# EAGLE design mosfet_brd (EAGLE 9.0.1)
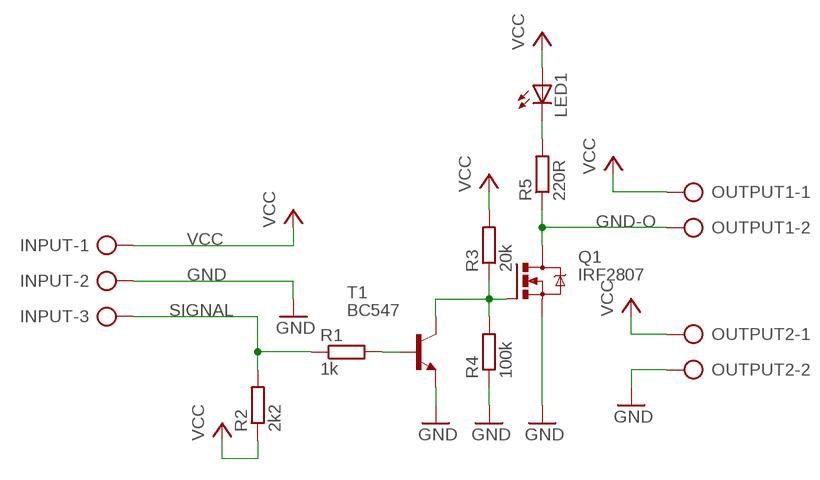
[diagram p0: schematic, sheet 1]

## Parts
INPUT  AK300/3  [AK300/3]
LED1  LED3MM  [LED3MM]
OUTPUT1  AK300/2  [AK300/2]
OUTPUT2  AK300/2  [AK300/2]
Q1  IRF2807  IRF540  [TO220BV]
R1  1k  R-EU_0411/15  [0411/15]
R2  2k2  R-EU_0411/15  [0411/15]
R3  20k  R-EU_0411/15  [0411/15]
R4  100k  R-EU_0411/15  [0411/15]
R5  220R  R-EU_0411/15  [0411/15]
T1  BC547  BC548  [TO92-EBC]

## Nets
GND: INPUT.2 OUTPUT2.2 Q1.S R4.1 T1.E
GND-O: OUTPUT1.2 Q1.D R5.1
N$2: R1.2 T1.B
N$5: Q1.G R3.1 R4.2 T1.C
N$7: LED1.K(C) R5.2
SIGNAL: INPUT.3 R1.1 R2.2
VCC: INPUT.1 LED1.A OUTPUT1.1 OUTPUT2.1 R2.1 R3.2

## Library data of the parts
INPUT = con-ptr500:AK300/3: CONNECTOR; OC_FARNELL: unknown; OC_NEWARK: unknown
LED1 = led:LED: LED OSRAM: - CHIPLED LG R971, LG N971, LY N971, LG Q971, LY Q971, LO R971, LY R971 LH N974, LH R974 LS Q976, LO Q976, LY Q976 LO Q996 - Hyper CHIPLED LW Q18S LB Q993, LB Q99A, LB R99A - SideLED LS A670, LO A670, LY A670, LG A670, LP A670 LB A673, LV A673, LT A673, LW A673 LH A674 LY A675 LS A676, LA A676, LO A676, LY A676, LW A676 LS A679, LY A679, LG A679 - Hyper Micro SIDELED® LS Y876, LA Y876, LO Y876, LY Y876 LT Y87S - SmartLED LW L88C, LW L88S LB L89C, LB L89S, LG L890 LS L89K, LO L89K, LY L89K LS L896, LA L896, LO L896, LY L896 - TOPLED LS T670, LO T670, LY T670, LG T670, LP T670 LSG T670, LSP T670, LSY T670, LOP T670, LYG T670 LG T671, LOG T671, LSG T671 LB T673, LV T673, LT T673, LW T673 LH T674 LS T676, LA T676, LO T676, LY T676, LB T676, LH T676, LSB T676, LW T676 LB T67C, LV T67C, LT T67C, LS T67K, LO T67K, LY T67K, LW E67C LS E67B, LA E67B, LO E67B, LY E67B, LB E67C, LV E67C, LT E67C LW T67C LS T679, LY T679, LG T679 LS T770, LO T770, LY T770, LG T770, LP T770 LB T773, LV T773, LT T773, LW T773 LH T774 LS E675, LA E675, LY E675, LS T675 LS T776, LA T776, LO T776, LY T776, LB T776 LHGB T686 LT T68C, LB T68C - Hyper Mini TOPLED® LB M676 - Mini TOPLED Santana® LG M470 LS M47K, LO M47K, LY M47K Source: http://www.osram.convergy.de LUXEON: - LUMILED® LXK2-PW12-R00, LXK2-PW12-S00, LXK2-PW14-U00, LXK2-PW14-V00 LXK2-PM12-R00, LXK2-PM12-S00, LXK2-PM14-U00 LXK2-PE12-Q00, LXK2-PE12-R00, LXK2-PE12-S00, LXK2-PE14-T00, LXK2-PE14-U00 LXK2-PB12-K00, LXK2-PB12-L00, LXK2-PB12-M00, LXK2-PB14-N00, LXK2-PB14-P00, LXK2-PB14-Q00 LXK2-PR12-L00, LXK2-PR12-M00, LXK2-PR14-Q00, LXK2-PR14-R00 LXK2-PD12-Q00, LXK2-PD12-R00, LXK2-PD12-S00 LXK2-PH12-R00, LXK2-PH12-S00 LXK2-PL12-P00, LXK2-PL12-Q00, LXK2-PL12-R00 Source: www.luxeon.com KINGBRIGHT: KA-3528ASYC Source: www.kingbright.com
OUTPUT1 OUTPUT2 = con-ptr500:AK300/2: CONNECTOR; OC_FARNELL: unknown; OC_NEWARK: unknown
Q1 = transistor-power:IRF540: HEXFET Power MOSFET
R1-R5 = resistor:R-EU_: RESISTOR, European symbol
T1 = transistor-npn:BC548*: NPN Transistor

## Board
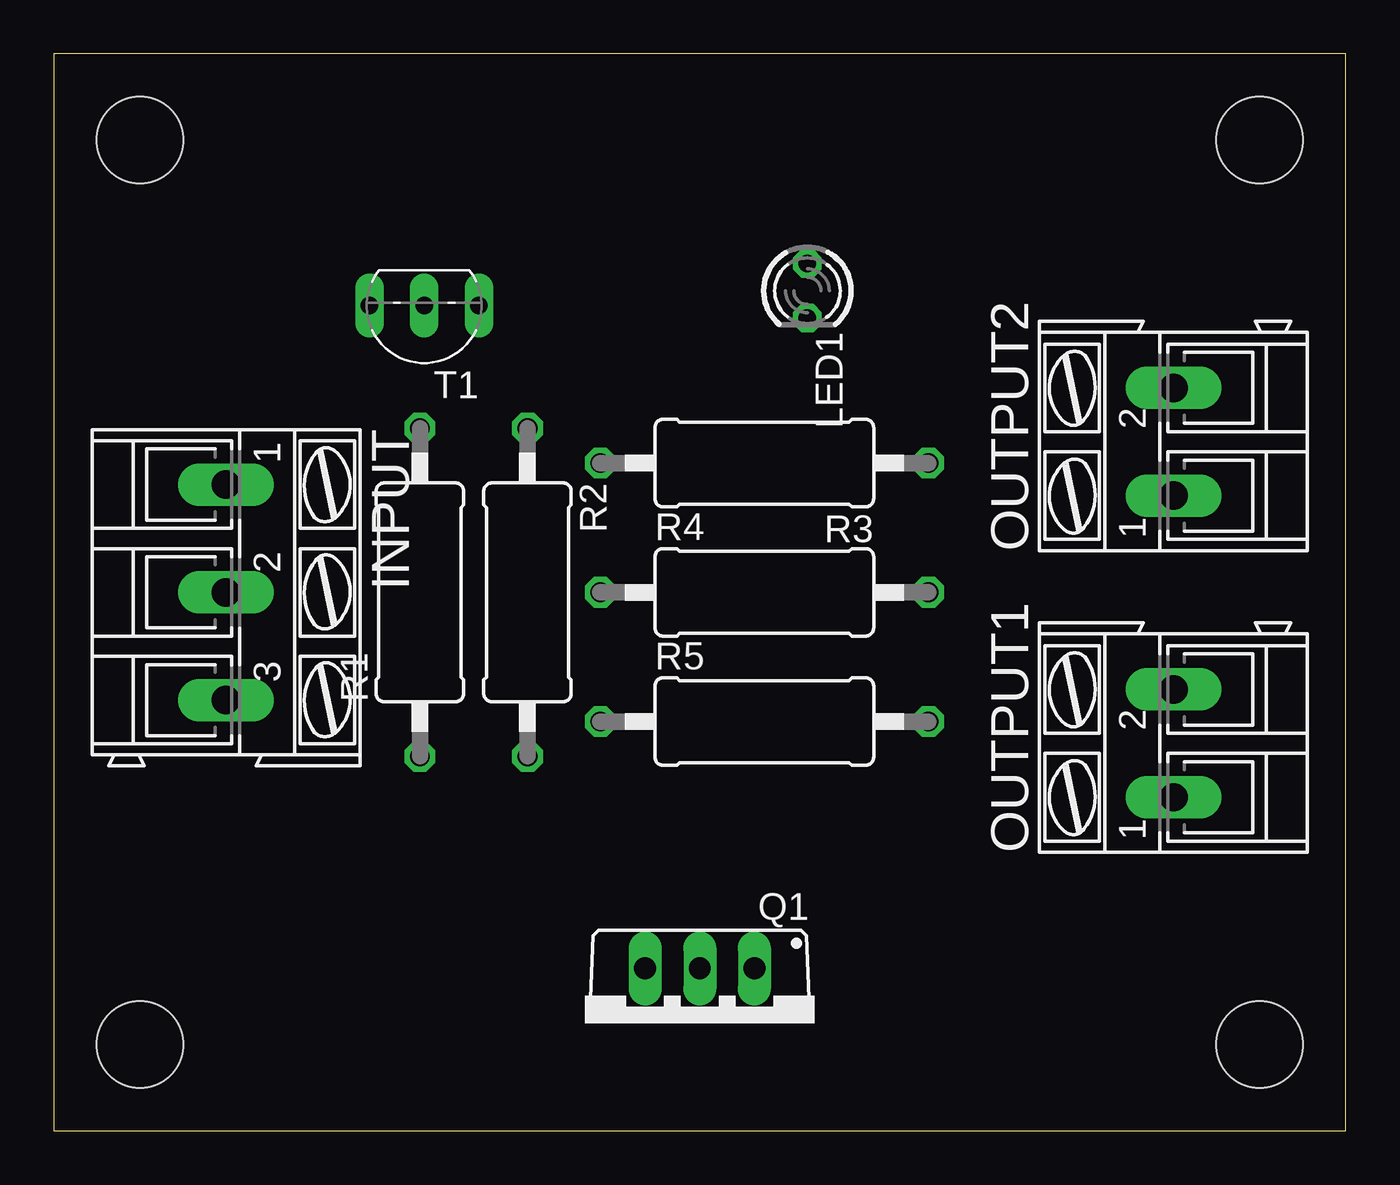
[diagram p1: board, top side]
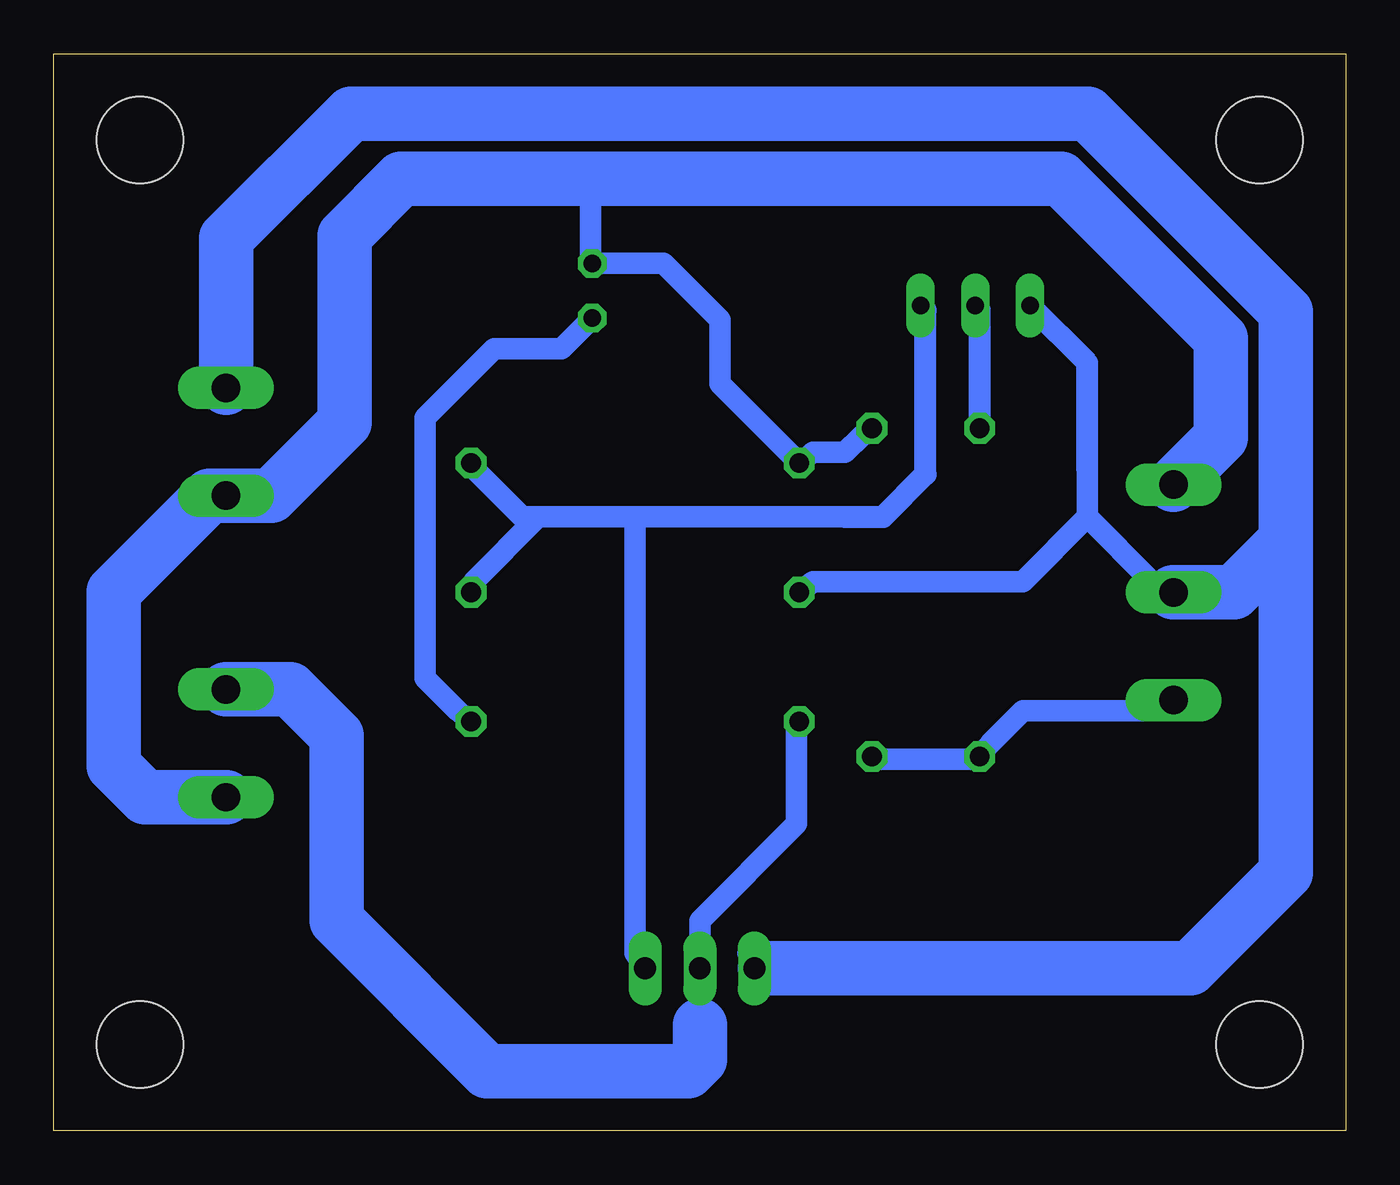
[diagram p2: board, bottom side, seen from below]

Size 60 x 50 mm. Coordinates in mm from the lower left corner, seen from the top.
Outline: 0,0 60,0 60,50 0,50 0,0
Copper layers (1*16): Top 0.035mm / dielectric 1.5mm / Bottom 0.035mm
Design rules "default *": minimum track width 1mm, minimum drill 1mm, track to track 0.5mm, track to pad 0.5mm, pad to pad 0.5mm, via to via 0.5mm, smd to smd 1mm, copper to edge 1.5mm, drill to drill 1.5mm, minimum pad ring 10mil, minimum via ring 8mil, stop-mask expansion 4mil, vias tented up to drill 0mil, thermal gap 0mil
Holes 4 mm at 4,46 56,46 56,4 4,4

### Footprints (pad centres in the part's own frame; a part is rotated, then mirrored left to right if it is on the bottom)
AK300/3 = drill 1.321 long: 1 -5.004,0; 2 0,0; 3 5.004,0
LED3MM = drill 0.813 octagon: A -1.27,0; K 1.27,0
AK300/2 = drill 1.321 long: 1 -2.515,0; 2 2.489,0
TO220BV = drill 1.016 long: D 0,-2.54; G -2.54,-2.54; S 2.54,-2.54
0411/15 = drill 0.914 octagon: 1 -7.62,0; 2 7.62,0
TO92-EBC = drill 0.813 long: B 0,-1.27; C -2.54,-1.27; E 2.54,-1.27

### Placement (x,y rotation side)
INPUT  8,25 270 top
LED1  35,39 270 top
OUTPUT1  52,18 90 top
OUTPUT2  52,32 90 top
Q1  30,5 180 top
R1  17,25 90 top
R2  22,25 270 top
R3  33,31 180 top
R4  33,25 0 top
R5  33,19 0 top
T1  17.2,37.04 180 top

### Tracks (layer width: path | path; a pad name or v marks a point on that pad's centre or on a via)
GND
  Bottom 1: 12,28.5 12,30.75 | 12,28.5 9,25.5 INPUT.2 | 12,28.5 15,25.5 24.75,25.5 R4.1 | Q1.S 27.75,8.25 26.96,7.54
  Bottom 1.016: 12,30.75 12,35.65 T1.E
  Bottom 2.54: INPUT.2 5.19,25 2.77,27.42 | OUTPUT2.2 52,41.43 46.2,47.23 11.98,47.23 2.77,38.02 2.77,27.42 | 26.96,7.54 7.21,7.54 2.77,11.98 2.77,27.42
GND-O
  Bottom 1: Q1.D 30,9.75 25.5,14.25 25.5,18.75 R5.1
  Bottom 1.016: Q1.D 30,4.9
  Bottom 2.54: OUTPUT1.2 49.03,20.49 46.87,18.33 46.87,9.77 39.87,2.77 30.54,2.77 30,3.31 30,4.9
N$2
  Bottom 1.016: R1.2 17,38.11 T1.B
N$5
  Bottom 1: 37.5,28.5 38.25,28.5 40.5,30.75 R3.1 | 37.5,28.5 33,28.5 | 33,28.5 23.25,28.5 | 37.5,28.5 40.5,25.5 R4.2 | 33,28.5 33,8.25 Q1.G
  Bottom 1.016: 23.25,28.5 21.48,28.5 19.51,30.47 19.51,38.08 T1.C
N$7
  Bottom 1: R5.2 41.25,19.5 42.75,21 42.75,33.11 39.56,36.3 36.43,36.3 LED1.K
SIGNAL
  Bottom 1: R2.2 21.75,17.25 17.25,17.25 R1.1 16.5,18 15,19.5 8.25,19.5 INPUT.3
VCC
  Bottom 1: R2.1 22.5,32.25 23.25,31.5 24.75,31.5 R3.2 29.06,34.68 29.06,37.65 31.68,40.27 LED1.A 35.08,40.35 35.08,44.19
  Bottom 2.54: OUTPUT1.1 55.77,15.48 57.23,16.95 57.23,25.02 52.77,29.48 OUTPUT2.1 49.91,29.48 46.5,32.89 46.5,41.55 43.86,44.19 35.08,44.19 13.23,44.19 5.81,36.77 5.81,32.19 INPUT.1